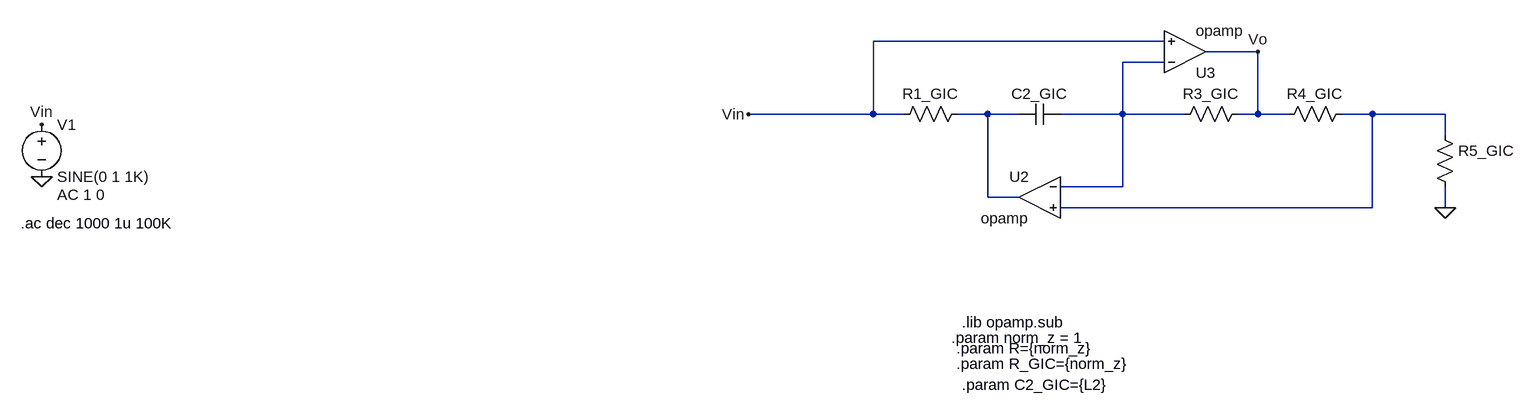
[diagram p0: schematic GIC.asc]
GIC.asc, the LTspice schematic file:
Version 4.1
SHEET 1 2160 696
WIRE 1600 32 1152 32
WIRE 1744 48 1664 48
WIRE 1600 64 1536 64
WIRE 1152 144 1152 32
WIRE 1152 144 960 144
WIRE 1200 144 1152 144
WIRE 1328 144 1280 144
WIRE 1376 144 1328 144
WIRE 1536 144 1536 64
WIRE 1536 144 1440 144
WIRE 1632 144 1536 144
WIRE 1744 144 1744 48
WIRE 1744 144 1712 144
WIRE 1792 144 1744 144
WIRE 1920 144 1872 144
WIRE 2032 144 1920 144
WIRE 2032 176 2032 144
WIRE 1536 256 1536 144
WIRE 1536 256 1440 256
WIRE 1328 272 1328 144
WIRE 1376 272 1328 272
WIRE 1920 288 1920 144
WIRE 1920 288 1440 288
WIRE 2032 288 2032 256
FLAG 960 144 Vin
FLAG -128 240 0
FLAG -128 160 Vin
FLAG 2032 288 0
FLAG 1744 48 Vo
SYMBOL voltage -128 144 R0
WINDOW 123 24 124 Left 2
WINDOW 39 0 0 Left 0
SYMATTR Value2 AC 1 0
SYMATTR InstName V1
SYMATTR Value SINE(0 1 1K)
SYMBOL res 1296 128 R90
WINDOW 0 0 56 VBottom 2
WINDOW 3 32 56 VTop 2
SYMATTR InstName R1_GIC
SYMATTR Value ""
SYMBOL cap 1440 128 R90
WINDOW 0 0 32 VBottom 2
WINDOW 3 32 32 VTop 2
SYMATTR InstName C2_GIC
SYMATTR Value ""
SYMBOL OpAmps\\opamp 1408 208 M0
SYMATTR InstName U2
SYMBOL OpAmps\\opamp 1632 112 M180
SYMATTR InstName U3
SYMBOL res 1728 128 R90
WINDOW 0 0 56 VBottom 2
WINDOW 3 32 56 VTop 2
SYMATTR InstName R3_GIC
SYMATTR Value ""
SYMBOL res 1888 128 R90
WINDOW 0 0 56 VBottom 2
WINDOW 3 32 56 VTop 2
SYMATTR InstName R4_GIC
SYMATTR Value ""
SYMBOL res 2016 160 R0
SYMATTR InstName R5_GIC
SYMATTR Value ""
TEXT -160 312 Left 2 !.ac dec 1000 1u 100K
TEXT 1288 464 Left 2 !.lib opamp.sub
TEXT 1272 488 Left 2 !.param norm_z = 1
TEXT 1280 504 Left 2 !.param R={norm_z}
TEXT 1280 528 Left 2 !.param R_GIC={norm_z}
TEXT 1288 560 Left 2 !.param C2_GIC={L2}

The netlist it stands for:
* GIC.asc
V1 Vin 0 SINE(0 1 1K) AC 1 0
R1_GIC N002 Vin
C2_GIC N001 N002
X§U2 N001 N003 N002 opamp Aol=100K GBW=10Meg  ; pins invin noninvin out
X§U3 N001 Vin Vo opamp Aol=100K GBW=10Meg  ; pins invin noninvin out
R3_GIC Vo N001
R4_GIC N003 Vo
R5_GIC N003 0
.ac dec 1000 1u 100K
.lib opamp.sub
.param norm_z = 1
.param R={norm_z}
.param R_GIC={norm_z}
.param C2_GIC={L2}
.backanno
.end